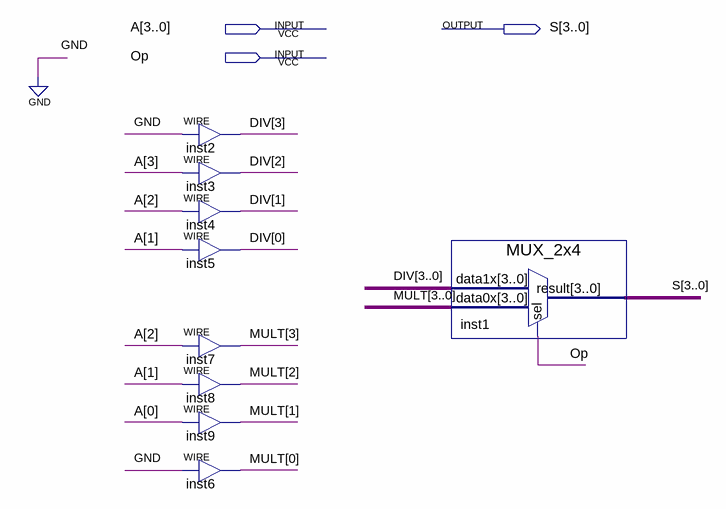
[diagram p0: schematic sheet]
// Quartus schematic DividerMultiplier.bdf as structural Verilog: 9 symbols, 3 pins
module DividerMultiplier (
  input  [3:0] A,
  input  Op,
  output [3:0] S
);

  wire [3:0] DIV, MULT;

  assign DIV[3] = 1'b0;  // WIRE inst2
  assign DIV[2] = A[3];  // WIRE inst3
  assign DIV[1] = A[2];  // WIRE inst4
  assign DIV[0] = A[1];  // WIRE inst5
  assign MULT[3] = A[2];  // WIRE inst7
  assign MULT[2] = A[1];  // WIRE inst8
  assign MULT[1] = A[0];  // WIRE inst9
  assign MULT[0] = 1'b0;  // WIRE inst6
  MUX_2x4 inst1 (.data1x(DIV), .data0x(MULT), .sel(Op), .result(S));
endmodule
